# Altium schematic sheet 02_memory.SchDoc
size A
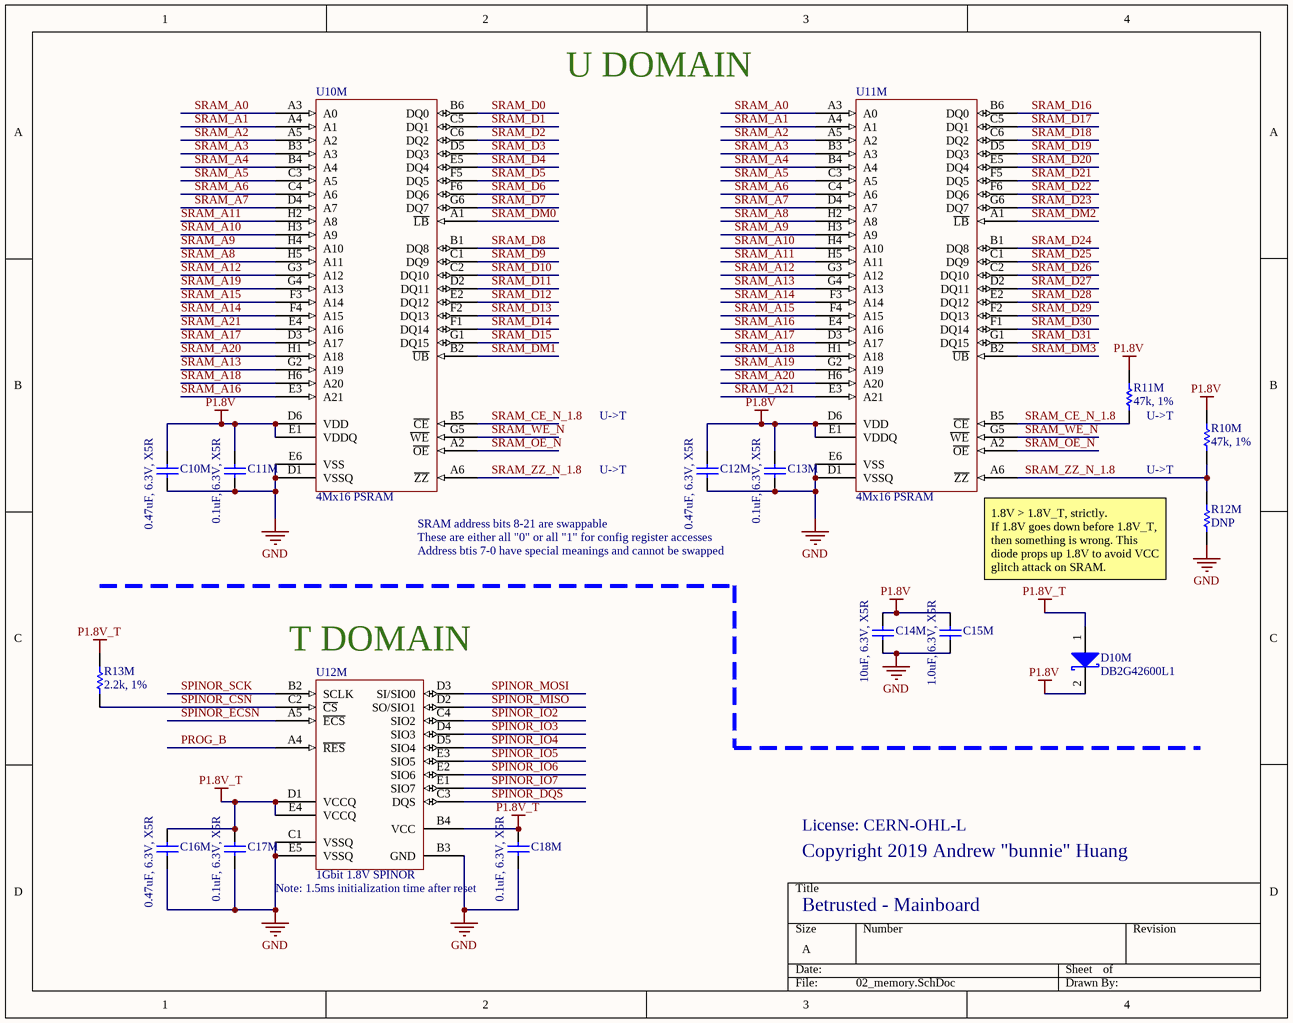
[diagram p0: 02_memory.SchDoc]

## Parts
C10M  0.47uF, 6.3V, X5R  [B_CAP0201]
C11M  0.1uF, 6.3V, X5R  [B_CAP0201]
C12M  0.47uF, 6.3V, X5R  [B_CAP0201]
C13M  0.1uF, 6.3V, X5R  [B_CAP0201]
C14M  10uF, 6.3V, X5R  [B_CAP0603]
C15M  1.0uF, 6.3V, X5R  [B_CAP0201]
C16M  0.47uF, 6.3V, X5R  [B_CAP0201]
C17M  0.1uF, 6.3V, X5R  [B_CAP0201]
C18M  0.1uF, 6.3V, X5R  [B_CAP0201]
D10M  DB2G42600L1  [B_DIO0402]
R10M  47k, 1%  [B_RES0201]
R11M  47k, 1%  [B_RES0201]
R12M  DNP  [B_RES0201]
R13M  2.2k, 1%  [B_RES0201]
U10M  4Mx16 PSRAM  [BGA48C75P6X8_600X800X120]
U11M  4Mx16 PSRAM  [BGA48C75P6X8_600X800X120]
U12M  1Gbit 1.8V SPINOR  [BGA24C100P5X5_600X800X120]

## Nets
GND: C10M.2 C11M.2 C12M.2 C13M.2 C14M.2 C15M.1 C16M.2 C17M.2 C18M.2 R12M.2 U10M.D1(VSSQ) U10M.E6(VSS) U11M.D1(VSSQ) U11M.E6(VSS) U12M.B3(GND) U12M.C1(VSSQ) U12M.E5(VSSQ)
P1.8V: C10M.1 C11M.1 C12M.1 C13M.1 C14M.1 C15M.2 D10M.2(K) R10M.1 R11M.1 U10M.D6(VDD) U10M.E1(VDDQ) U11M.D6(VDD) U11M.E1(VDDQ)
P1.8V_T: C16M.1 C17M.1 C18M.1 D10M.1(A) R13M.2 U12M.B4(VCC) U12M.D1(VCCQ) U12M.E4(VCCQ)
PROG_B: U12M.A4(~{RES})
SPINOR_CSN: R13M.1 U12M.C2(~{CS})
SPINOR_DQS: U12M.C3(DQS)
SPINOR_ECSN: U12M.A5(~{ECS})
SPINOR_IO2: U12M.C4(SIO2)
SPINOR_IO3: U12M.D4(SIO3)
SPINOR_IO4: U12M.D5(SIO4)
SPINOR_IO5: U12M.E3(SIO5)
SPINOR_IO6: U12M.E2(SIO6)
SPINOR_IO7: U12M.E1(SIO7)
SPINOR_MISO: U12M.D2(SO/SIO1)
SPINOR_MOSI: U12M.D3(SI/SIO0)
SPINOR_SCK: U12M.B2(SCLK)
SRAM_A0: U10M.A3(A0) U11M.A3(A0)
SRAM_A1: U10M.A4(A1) U11M.A4(A1)
SRAM_A2: U10M.A5(A2) U11M.A5(A2)
SRAM_A3: U10M.B3(A3) U11M.B3(A3)
SRAM_A4: U10M.B4(A4) U11M.B4(A4)
SRAM_A5: U10M.C3(A5) U11M.C3(A5)
SRAM_A6: U10M.C4(A6) U11M.C4(A6)
SRAM_A7: U10M.D4(A7) U11M.D4(A7)
SRAM_A8: U10M.H5(A11) U11M.H2(A8)
SRAM_A9: U10M.H4(A10) U11M.H3(A9)
SRAM_A10: U10M.H3(A9) U11M.H4(A10)
SRAM_A11: U10M.H2(A8) U11M.H5(A11)
SRAM_A12: U10M.G3(A12) U11M.G3(A12)
SRAM_A13: U10M.G2(A19) U11M.G4(A13)
SRAM_A14: U10M.F4(A15) U11M.F3(A14)
SRAM_A15: U10M.F3(A14) U11M.F4(A15)
SRAM_A16: U10M.E3(A21) U11M.E4(A16)
SRAM_A17: U10M.D3(A17) U11M.D3(A17)
SRAM_A18: U10M.H6(A20) U11M.H1(A18)
SRAM_A19: U10M.G4(A13) U11M.G2(A19)
SRAM_A20: U10M.H1(A18) U11M.H6(A20)
SRAM_A21: U10M.E4(A16) U11M.E3(A21)
SRAM_CE_N_1.8: R11M.2 U10M.B5(~{CE}) U11M.B5(~{CE})
SRAM_D0: U10M.B6(DQ0)
SRAM_D1: U10M.C5(DQ1)
SRAM_D2: U10M.C6(DQ2)
SRAM_D3: U10M.D5(DQ3)
SRAM_D4: U10M.E5(DQ4)
SRAM_D5: U10M.F5(DQ5)
SRAM_D6: U10M.F6(DQ6)
SRAM_D7: U10M.G6(DQ7)
SRAM_D8: U10M.B1(DQ8)
SRAM_D9: U10M.C1(DQ9)
SRAM_D10: U10M.C2(DQ10)
SRAM_D11: U10M.D2(DQ11)
SRAM_D12: U10M.E2(DQ12)
SRAM_D13: U10M.F2(DQ13)
SRAM_D14: U10M.F1(DQ14)
SRAM_D15: U10M.G1(DQ15)
SRAM_D16: U11M.B6(DQ0)
SRAM_D17: U11M.C5(DQ1)
SRAM_D18: U11M.C6(DQ2)
SRAM_D19: U11M.D5(DQ3)
SRAM_D20: U11M.E5(DQ4)
SRAM_D21: U11M.F5(DQ5)
SRAM_D22: U11M.F6(DQ6)
SRAM_D23: U11M.G6(DQ7)
SRAM_D24: U11M.B1(DQ8)
SRAM_D25: U11M.C1(DQ9)
SRAM_D26: U11M.C2(DQ10)
SRAM_D27: U11M.D2(DQ11)
SRAM_D28: U11M.E2(DQ12)
SRAM_D29: U11M.F2(DQ13)
SRAM_D30: U11M.F1(DQ14)
SRAM_D31: U11M.G1(DQ15)
SRAM_DM0: U10M.A1(~{LB})
SRAM_DM1: U10M.B2(~{UB})
SRAM_DM2: U11M.A1(~{LB})
SRAM_DM3: U11M.B2(~{UB})
SRAM_OE_N: U10M.A2(~{OE}) U11M.A2(~{OE})
SRAM_WE_N: U10M.G5(~{WE}) U11M.G5(~{WE})
SRAM_ZZ_N_1.8: R10M.2 R12M.1 U10M.A6(~{ZZ}) U11M.A6(~{ZZ})

## Notes on the sheet
- U DOMAIN
- U->T
- (near R11M) U->T
- (near U10M) SRAM address bits 8-21 are swappable
- These are either all "0" or all "1" for config register accesses
- Address btis 7-0 have special meanings and cannot be swapped
- (near U11M) 1.8V > 1.8V_T, strictly.
  If 1.8V goes down before 1.8V_T, then something is wrong. This diode props up 1.8V to avoid VCC glitch attack on SRAM.
- (near U12M) T DOMAIN
- License: CERN-OHL-L
- Note: 1.5ms initialization time after reset
- Copyright 2019 Andrew "bunnie" Huang
- Betrusted - Mainboard

## Library data of the parts
C10M C12M C16M = Cap Semi: Capacitor (Semiconductor SIM Model); MPN: CL03A474KQ3NNNH; VENDOR: Samsung; MYPN: C-474-6p3-X5R-0201
C11M C13M C17M C18M = Cap Semi: Capacitor (Semiconductor SIM Model); MPN: CL03A104KQ3NNNC; VENDOR: Samsung; MYPN: C-104-6p3-X5R-0201
C14M = Cap Semi: Capacitor (Semiconductor SIM Model); MPN: CL10A106MQ8NNNC; VENDOR: Samsung; MYPN: C-106-6.3-X5R-0603
C15M = Cap Semi: Capacitor (Semiconductor SIM Model); MPN: GRM033R60J105MEA2D; VENDOR: Murata; MYPN: C-105-6p3-X5R-0201
D10M = Diode 11DQ03: Schottky Rectifier; MYPN: D-SCHOTTKY-0402-CSP; VENDOR: Panasonic; ComponentLink1Description: Manufacturer Link; ComponentLink1URL: http://www.irf.com/; ComponentLink2Description: Datasheet; ComponentLink2URL: http://www.irf.com/product-info/datasheets/data/11dq03.pdf; MPN: DB2G42600L1
R10M R11M = Res1: Resistor; VENDOR: ANY; MYPN: R-473-1P-1_16W-0201; MPN: ANY
R12M = Res1: Resistor; VENDOR: ANY; MYPN: DNP; MPN: ANY
R13M = Res1: Resistor; VENDOR: ANY; MYPN: R-222-1P-1_16W-0201; MPN: ANY
U10M U11M = IS66WVE4M16: MPN: IS66WVE4M16EALL-70BLI; MYPN: U-IS66WVE4M16EALL-70BLI; VENDOR: ISSI
U12M = MX66UM1G45G: 1.8V 1Gbit x1/x8 OctaFlash SPINOR; MPN: MX66UM1G45GXDI00; VENDOR: Macronix; MYPN: U-MX66UM1G45GXDI00